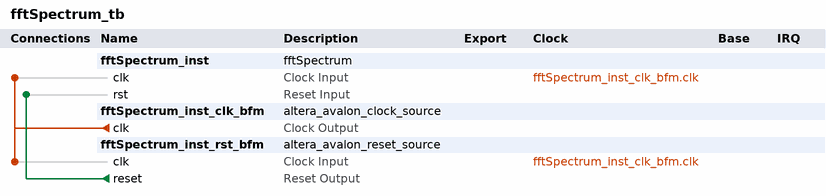
[diagram p0: system contents]
# Platform Designer (Qsys) system fftSpectrum_tb, Cyclone V 5CSEBA6U23I7DK
# Parameters at their usual value, and those the tool derives, are not listed.
package require -exact qsys 17.0
create_system fftSpectrum_tb
set_project_property DEVICE_FAMILY {Cyclone V}
set_project_property DEVICE 5CSEBA6U23I7DK

add_instance fftSpectrum_inst fftSpectrum 1.0

add_instance fftSpectrum_inst_clk_bfm altera_avalon_clock_source 17.0

add_instance fftSpectrum_inst_rst_bfm altera_avalon_reset_source 17.0
set_instance_parameter_value fftSpectrum_inst_rst_bfm ASSERT_HIGH_RESET 0
set_instance_parameter_value fftSpectrum_inst_rst_bfm INITIAL_RESET_CYCLES 50

# connections
add_connection fftSpectrum_inst_clk_bfm.clk fftSpectrum_inst.clk clock
add_connection fftSpectrum_inst_clk_bfm.clk fftSpectrum_inst_rst_bfm.clk clock
add_connection fftSpectrum_inst_rst_bfm.reset fftSpectrum_inst.rst reset

set_interconnect_requirement {$system} qsys_mm.clockCrossingAdapter HANDSHAKE
set_interconnect_requirement {$system} qsys_mm.enableEccProtection FALSE
set_interconnect_requirement {$system} qsys_mm.insertDefaultSlave FALSE
set_interconnect_requirement {$system} qsys_mm.maxAdditionalLatency 1

save_system fftSpectrum_tb.qsys
